# Altium schematic sheet Alim.SchDoc
size A4
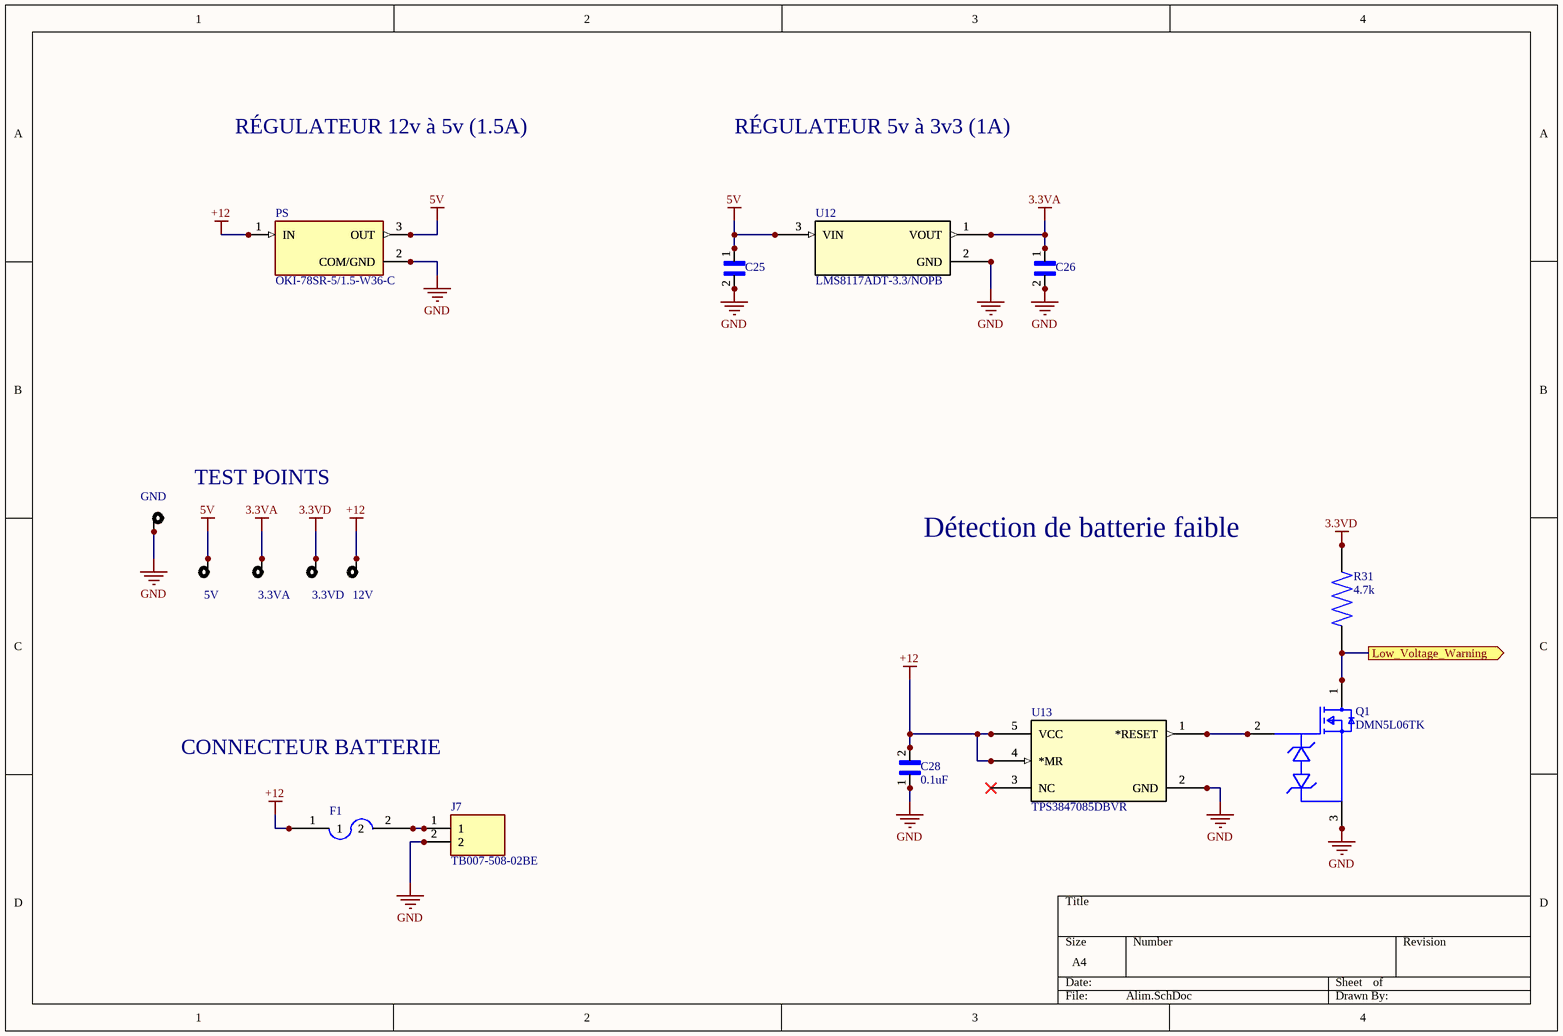
[diagram p0: Alim.SchDoc]

## Parts
3.3VA  RCS-0C  [RCS-0C]  (value not drawn)
3.3VD  RCS-0C  [RCS-0C]  (value not drawn)
5V  RCS-0C  [RCS-0C]  (value not drawn)
12V  RCS-0C  [RCS-0C]  (value not drawn)
C25  TAJP106K010RNJ  [CAPC2012X140N]  (value not drawn)
C26  TAJP106K010RNJ  [CAPC2012X140N]  (value not drawn)
C28  value 0.1uF  [C3216C0G1H104J160AA]  (hidden comment: C3216C0G1H104J160AA)
F1  MF-SM150/33-2  [MF-SM150/33-2]  (value not drawn)
GND  RCS-0C  [RCS-0C]  (value not drawn)
J7  TB007-508-02BE  [CUI_TB007-508-02BE]
PS  OKI-78SR-5/1.5-W36-C  [CONV_OKI-78SR-5/1.5-W36-C]
Q1  DMN5L06TK  [DMN5L06TK]
R31  value 4.7k  [CRGH0805F4K7]  (hidden comment: CRGH0805F4K7)
U12  LMS8117ADT-3.3/NOPB  [TD03B]
U13  TPS3847085DBVR  [DBV5_TEX-M]

## Ports
Low_Voltage_Warning (out)

## Nets
3.3VA: 3.3VA.1 C26.1 U12.1(VOUT)
3.3VD: 3.3VD.1 R31.2
5V: 5V.1 C25.1 PS.3(OUT) U12.3(VIN)
+12: 12V.1 C28.2 F1.1 PS.1(IN) U13.4(*MR) U13.5(VCC)
GND: C25.2 C26.2 C28.1 GND.1 J7.2 PS.2(COM/GND) Q1.3(S) U12.2(GND) U13.2(GND)
Low_Voltage_Warning: Q1.1(D) R31.1 ; port Low_Voltage_Warning
NetF1_2: F1.2 J7.1
NetQ1_2: Q1.2(G) U13.1(*RESET)

Not connected (* = marked no-connect by the designer): U13 3(NC)*

## Notes on the sheet
- RÉGULATEUR 12v à 5v (1.5A)
- RÉGULATEUR 5v à 3v3 (1A)
- (near GND) TEST POINTS
- (near R31) Détection de batterie faible
- CONNECTEUR BATTERIE

## Library data of the parts
3.3VA 3.3VD 5V 12V GND = RCS-0C: PC TEST POINT NATURAL
C25 C26 = TAJP106K010RNJ: TANTALUM CAPACITOR, 10UF, 10V, 0805 10%,; Package: None; Price: None; Value: 10uF; MP: TAJP106K010RNJ; Availability: Unavailable; Parameter 1: *
F1 = MF-SM150/33-2: PTC RESET FUSE 33V 1.5A 2SMD
J7 = TB007-508-02BE: 2~24 Poles, Screw Type, Horizontal, 5.08 Pitch, 24~12 _AWG_, Terminal Block Connector; MF: CUI Devices; SnapEDA_Link: https://www.snapeda.com/parts/TB007-508-02BE/CUI%20Devices/view-part/3591212/?ref=snap; Value: *; Availability: Unavailable; MP: TB007-508-02BE; Price: None; Package: None
PS = OKI-78SR-5/1.5-W36-C: Linear Regulator Replacement DC DC Converter 1 Output 5V 1.5A 7V - 36V Input; MF: Murata Power; Availability: Unavailable; Price: None; Package: SIP-3 Murata Power; Value: *; SnapEDA_Link: https://www.snapeda.com/parts/OKI-78SR-5/1.5-W36-C/Murata%20Power%20Solutions%20Inc./view-part/229597/?ref=snap; MP: OKI-78SR-5/1.5-W36-C
R31 = CRGH0805F4K7: CRGH0805 1% 4K7 0.33W; Tolerance: ±1%
U12 = LMS8117ADT-3.3/NOPB: No Description Available; PartNumber: LMS8117ADT-33; Comp: TypeLDO; Vendor: NationalSemiconductor; Symbol: NameLMS8117ADT-33; Library: ReferenceLMS8117ADT; Type: DEV; Version: 1; base_pn: LMS8117A; Pin: Count3; Copyright: Copyright (C) 2021 Accelerated Designs. All rights reserved; RefDes: RefDes
U13 = TPS3847085DBVR: No Description Available; Vendor: Texas Instruments; Built_By: EMA_UL_Team; SourceLibrary: TI_2017-02-16; Manufacturer_Part_Number: TPS3847085DBVR; Copyright: Copyright (C) 2021 Accelerated Designs. All rights reserved; RefDes: RefDes; Type: DEV